# Altium schematic sheet myCar.SchDoc
size A2
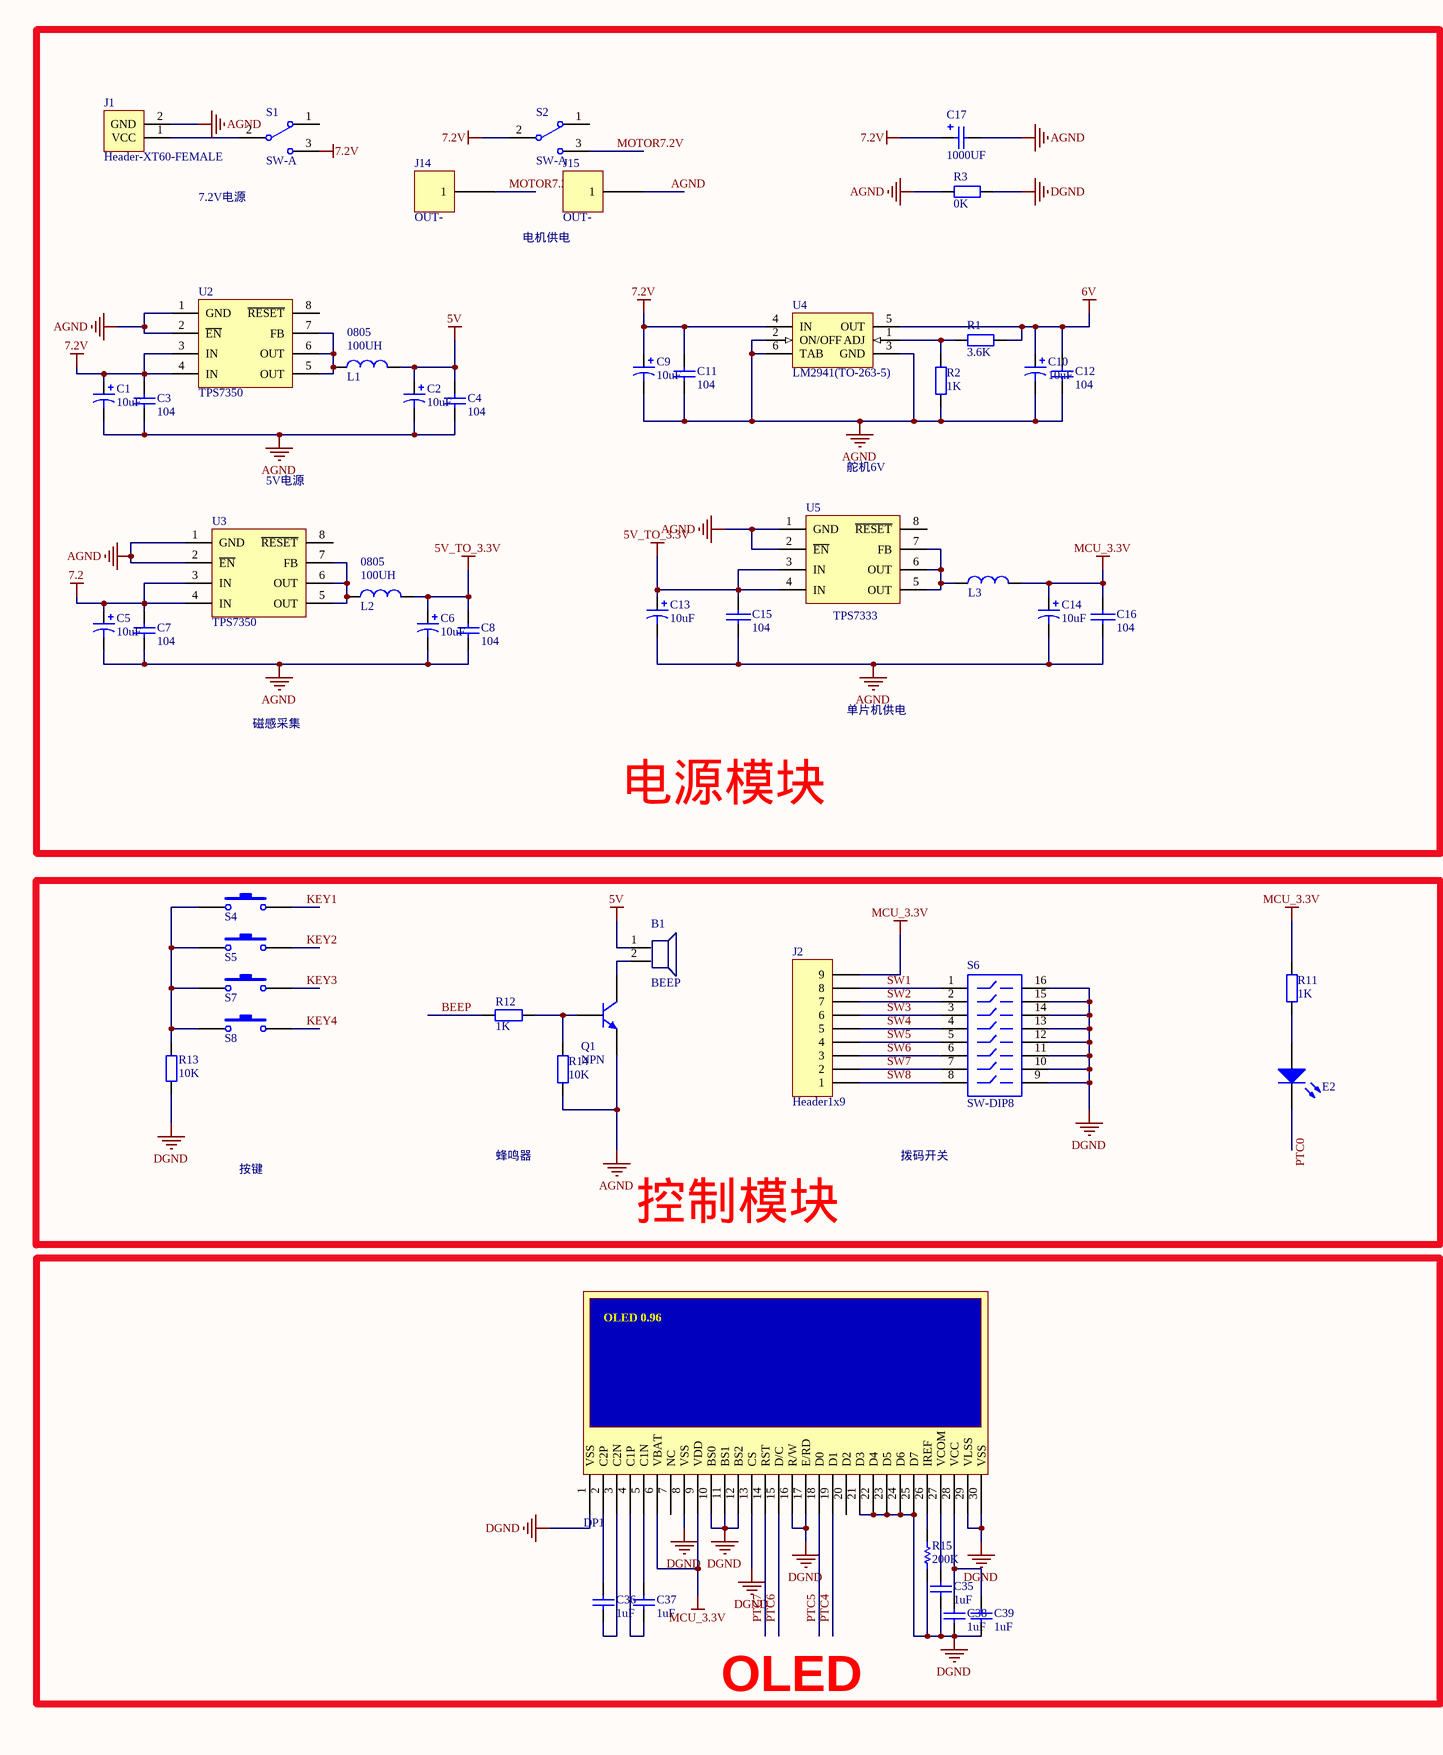
[diagram p0: myCar.SchDoc, left]
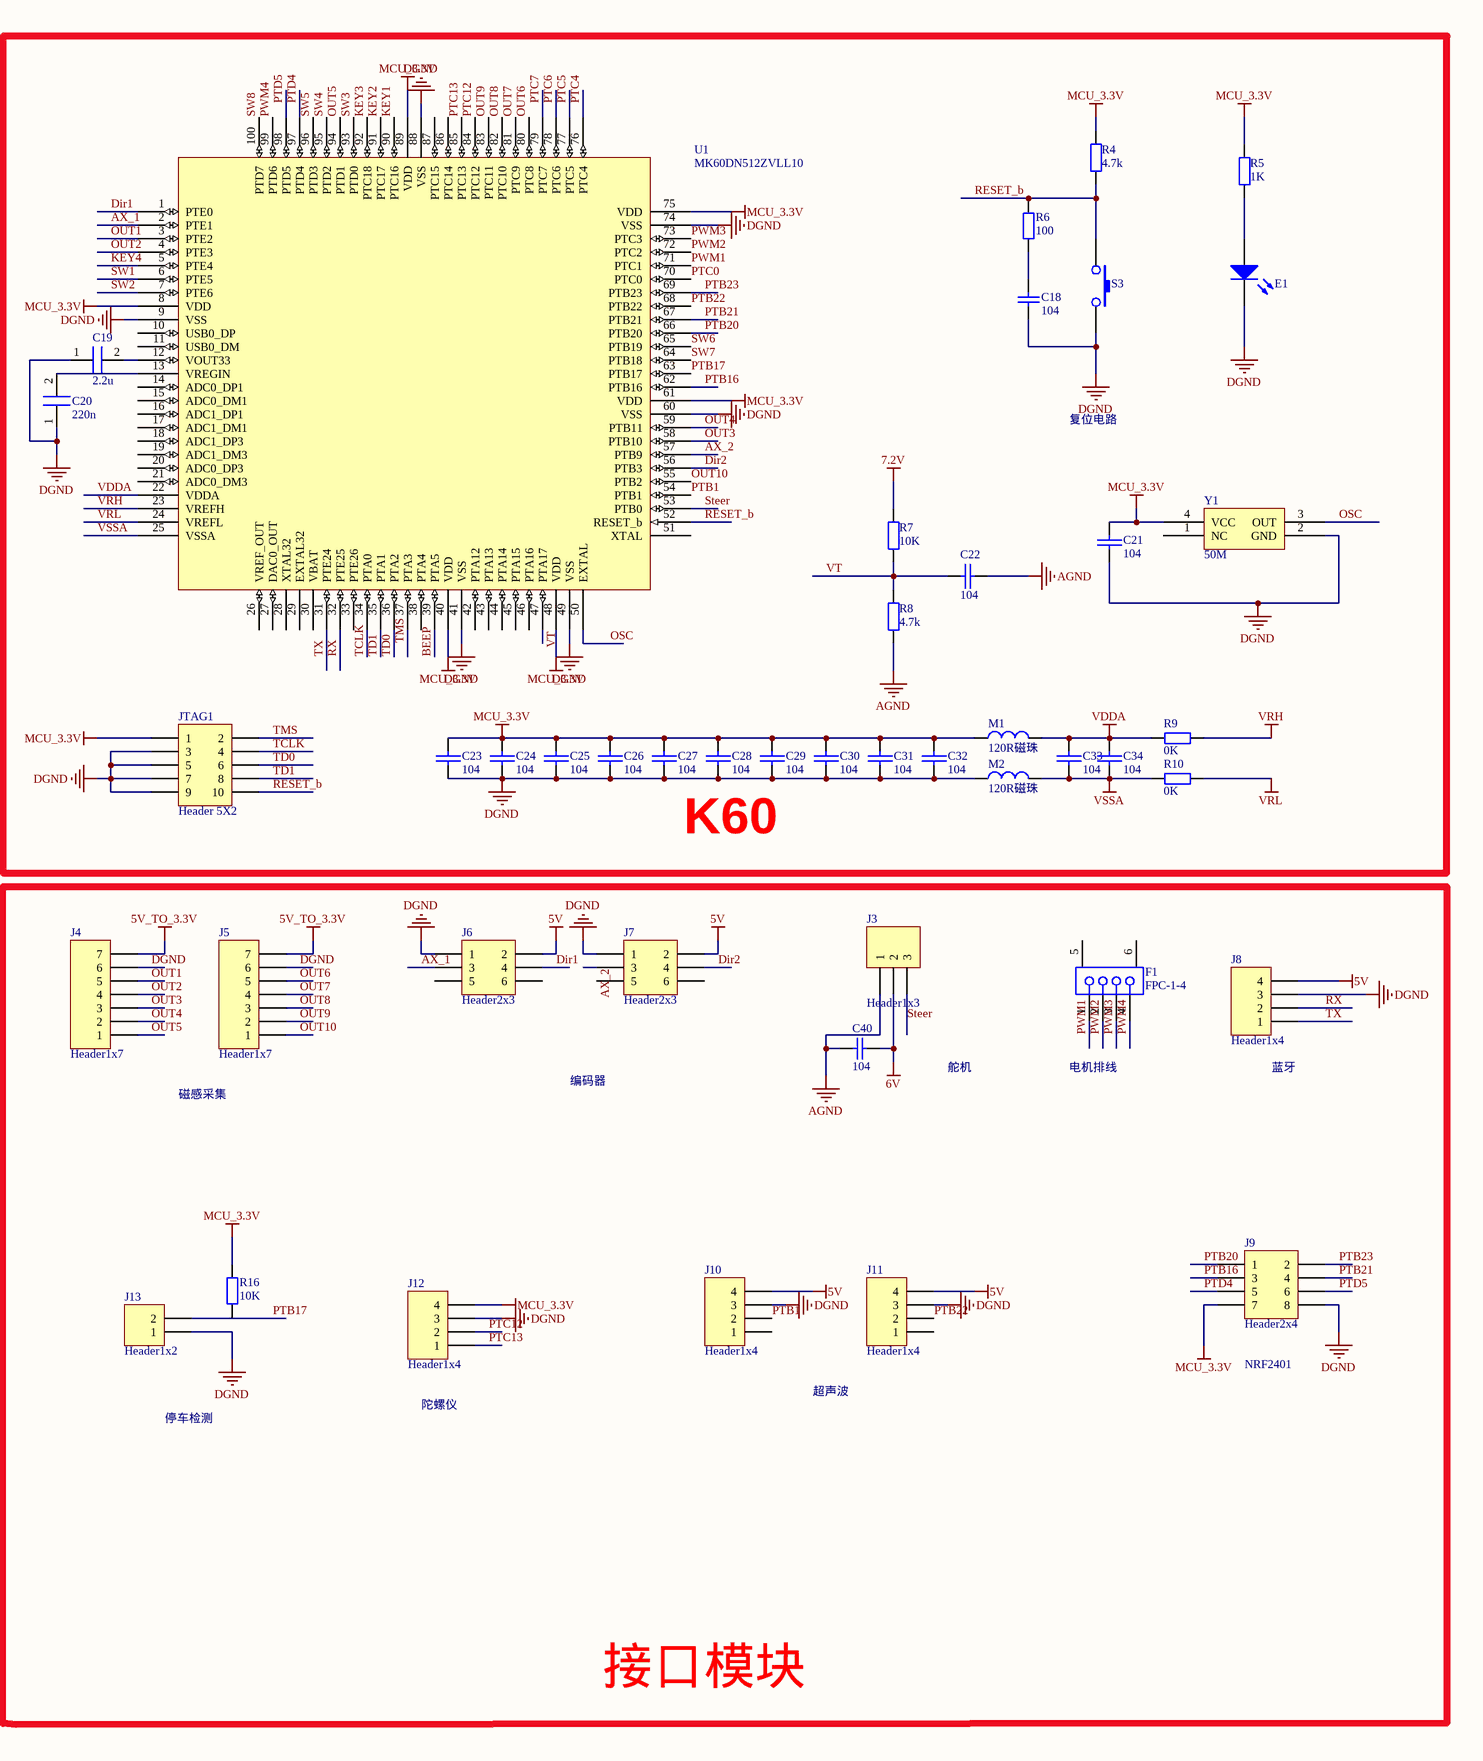
[diagram p1: myCar.SchDoc, right]

## Parts
B1  BEEP  [BEEP0905]
C1  value 10uF  [CAP_3216（1206）]  (hidden comment: 10uF/16V)
C2  value 10uF  [CAP_3216（1206）]  (hidden comment: 10uF/16V)
C3  104  [0603RC]
C4  104  [0603RC]
C5  value 10uF  [CAP_3216（1206）]  (hidden comment: 10uF/16V)
C6  value 10uF  [CAP_3216（1206）]  (hidden comment: 10uF/16V)
C7  104  [0603RC]
C8  104  [0603RC]
C9  value 10uF  [CAP_3216（1206）]  (hidden comment: 10uF/16V)
C10  value 10uF  [CAP_3216（1206）]  (hidden comment: 10uF/16V)
C11  104  [0603RC]
C12  104  [0603RC]
C13  value 10uF  [CAP_3216（1206）]  (hidden comment: 10uF/16V)
C14  value 10uF  [CAP_3216（1206）]  (hidden comment: 10uF/16V)
C15  104  [0603RC]
C16  104  [0603RC]
C17  CAP-SMD-1000UF  [CAP-SMD-1000UF]  (value not drawn)
C18  104  [0603RC]
C19  C: 2.2u  [0603RC]  (hidden comment: C0603)
C20  C: 220n  [0603RC]  (hidden comment: C0603)
C21  104  [0603RC]
C22  104  [0603RC]
C23  104  [0603RC]
C24  104  [0603RC]
C25  104  [0603RC]
C26  104  [0603RC]
C27  104  [0603RC]
C28  104  [0603RC]
C29  104  [0603RC]
C30  104  [0603RC]
C31  104  [0603RC]
C32  104  [0603RC]
C33  104  [0603RC]
C34  104  [0603RC]
C35  value 1uF  [0603RC]  (hidden comment: Cap)
C36  value 1uF  [0603RC]  (hidden comment: Cap)
C37  value 1uF  [0603RC]  (hidden comment: Cap)
C38  value 1uF  [0603RC]  (hidden comment: Cap)
C39  value 1uF  [0603RC]  (hidden comment: Cap)
C40  104  [0603RC]
DP1  OLED  [OLED_0.96]  (value not drawn)
E1  LED0  [LED-0603]  (value not drawn)
E2  LED0  [LED-0603]  (value not drawn)
F1  FPC-1-4  [FPC-1-4]
J1  Header-XT60-FEMALE  [HEADER-XT60-FEMALE]
J2  Header1x9  [HEADER1X9]
J3  Header1x3  [HEADER1X3]
J4  Header1x7  [HEADER1X7]
J5  Header1x7  [HEADER1X7]
J6  Header2x3  [HEADER2X3]
J7  Header2x3  [HEADER2X3]
J8  Header1x4  [HEADER1X4]
J9  Header2x4  [HEADER2X4]
J10  Header1x4  [HEADER1X4]
J11  Header1x4  [HEADER1X4]
J12  Header1x4  [HEADER1X4]
J13  Header1x2  [HEADER1X2]
J14  OUT-  [HEADER1X1]
J15  OUT-  [HEADER1X1]
JTAG1  Header 5X2  [HEADER2X5]
L1  INTUCTOR  [L0805 - duplicate]  (value not drawn)
L2  INTUCTOR  [L0805 - duplicate]  (value not drawn)
L3  INTUCTOR  [L0805 - duplicate]  (value not drawn)
M1  120R磁珠  [bead0805]
M2  120R磁珠  [bead0805]
Q1  NPN  [SOT-23]
R1  RES  [0603RC]  (value not drawn)
R2  1K  [0603RC]
R3  RES  [0603RC]  (value not drawn)
R4  value 4.7k  [0603RC]  (hidden comment: 2K)
R5  1K  [0603RC]
R6  RES  [0603RC]  (value not drawn)
R7  10K  [0603RC]
R8  value 4.7k  [0603RC]  (hidden comment: 2K)
R9  RES  [0603RC]  (value not drawn)
R10  RES  [0603RC]  (value not drawn)
R11  1K  [0603RC]
R12  1K  [0603RC]
R13  RES  [0603RC]  (value not drawn)
R14  10K  [0603RC]
R15  value 200K  [0603RC]  (hidden comment: Res)
R16  RES  [0603RC]  (value not drawn)
S1  SW-A  [SW-B]
S2  SW-A  [SW-B]
S3  SW-PB  [SWITCH]  (value not drawn)
S4  SW-PB  [SWITCH]  (value not drawn)
S5  SW-PB  [SWITCH]  (value not drawn)
S6  SW-DIP8  [DIP-16]
S7  SW-PB  [SWITCH]  (value not drawn)
S8  SW-PB  [SWITCH]  (value not drawn)
U1  MK60DN512ZVLL10  [QFP100]
U2  TPS7350  [TPS7350(7333)]
U3  TPS7350  [TPS7350(7333)]
U4  LM2941(TO-263-5)  [TO-263-5]
U5  TPS7333  [TPS7350(7333)]
Y1  50M  [50M晶振(5032)]

## Blocks framed on the sheet
电源模块: C1-C17 J1 J14 J15 L1-L3 R1-R3 S1 S2 U2-U5
K60: C18-C34 E1 JTAG1 M1 M2 R4-R10 S3 U1 Y1
控制模块: B1 E2 J2 Q1 R11-R14 S4-S8
接口模块: C40 F1 J3-J13 R16
OLED: C35-C39 DP1 R15

## Nets
5V: B1.1(VCC) C2.1 C4.2 J6.2 J7.2 J8.4 J10.4 J11.4 L1.2
5V_TO_3.3V: C6.1 C8.1 C13.1 C15.1 J4.7 J5.7 L2.2 U5.3(IN) U5.4(IN)
6V: C10.1 C12.2 C40.2 J3.2 R1.2 U4.5(OUT)
7.2: C5.1 C7.2 U3.3(IN) U3.4(IN)
7.2V: C1.1 C3.2 C9.1 C11.2 C17.1 R7.2 S1.3 S2.2 U2.3(IN) U2.4(IN) U4.4(IN)
AGND: C1.2 C2.2 C3.1 C4.1 C5.2 C6.2 C7.1 C8.2 C9.2 C10.2 C11.1 C12.1 C13.2 C14.2 C15.2 C16.2 C17.2 C22.2 C40.1 J1.2(GND) J3.1 J15.1 Q1.2(E) R2.1 R3.1 R8.1 R14.1 U2.1(GND) U2.2(~{EN}) U3.1(GND) U3.2(~{EN}) U4.2(ON/OFF) U4.3(GND) U4.6(TAB) U5.1(GND) U5.2(~{EN})
DGND: C18.1 C19.1 C20.1 C21.2 C23.2 C24.2 C25.2 C26.2 C27.2 C28.2 C29.2 C30.2 C31.2 C32.2 C35.1 C38.2 C39.1 DP1.1(VSS) DP1.8(VSS) DP1.10(BS0) DP1.11(BS1) DP1.12(BS2) DP1.13(CS) DP1.16(R/W) DP1.17(E/RD) DP1.21(D3) DP1.22(D4) DP1.23(D5) DP1.24(D6) DP1.25(D7) DP1.29(VLSS) DP1.30(VSS) E1.2 J4.6 J5.6 J6.1 J7.1 J8.3 J9.8 J10.3 J11.3 J12.3 J13.1 JTAG1.3 JTAG1.5 JTAG1.7 JTAG1.9 M2.1 R3.2 R13.1 R15.1 S3.2 S6.9 S6.10 S6.11 S6.12 S6.13 S6.14 S6.15 S6.16 U1.9(VSS) U1.41(VSS) U1.49(VSS) U1.60(VSS) U1.74(VSS) U1.88(VSS) Y1.2(GND)
MCU_3.3V: C14.1 C16.1 C21.1 C23.1 C24.1 C25.1 C26.1 C27.1 C28.1 C29.1 C30.1 C31.1 C32.1 DP1.6(VBAT) DP1.9(VDD) J2.9 J9.7 J12.4 JTAG1.1 L3.2 M1.1 R4.2 R5.2 R11.2 R16.2 U1.8(VDD) U1.40(VDD) U1.48(VDD) U1.61(VDD) U1.75(VDD) U1.89(VDD) Y1.4(VCC)
VDDA: C33.1 C34.1 M1.2 R9.1 U1.22(VDDA)
VRH: R9.2 U1.23(VREFH)
VRL: R10.2 U1.24(VREFL)
VSSA: C33.2 C34.2 M2.2 R10.1 U1.25(VSSA)
AX_1: J6.3 U1.2(PTE1)
AX_2: J7.3 U1.57(PTB9)
BEEP: R12.1 U1.39(PTA5)
Dir1: J6.4 U1.1(PTE0)
Dir2: J7.4 U1.56(PTB3)
KEY1: S4.2 U1.90(PTC16)
KEY2: S5.2 U1.91(PTC17)
KEY3: S7.2 U1.92(PTC18)
KEY4: S8.2 U1.5(PTE4)
MOTOR7.2V: J14.1 S2.3
OSC: U1.50(EXTAL) Y1.3(OUT)
OUT1: J4.5 U1.3(PTE2)
OUT2: J4.4 U1.4(PTE3)
OUT3: J4.3 U1.58(PTB10)
OUT4: J4.2 U1.59(PTB11)
OUT5: J4.1 U1.94(PTD1)
OUT6: J5.5 U1.80(PTC8)
OUT7: J5.4 U1.81(PTC9)
OUT8: J5.3 U1.82(PTC10)
OUT9: J5.2 U1.83(PTC11)
OUT10: J5.1 U1.55(PTB2)
PTB1: J10.2 U1.54(PTB1)
PTB16: J9.3 U1.62(PTB16)
PTB17: J13.2 U1.63(PTB17)
PTB20: J9.1 U1.66(PTB20)
PTB21: J9.4 U1.67(PTB21)
PTB22: J11.2 U1.68(PTB22)
PTB23: J9.2 U1.69(PTB23)
PTC0: E2.2 U1.70(PTC0)
PTC4: DP1.19(D1) U1.76(PTC4)
PTC5: DP1.18(D0) U1.77(PTC5)
PTC6: DP1.15(D/C) U1.78(PTC6)
PTC7: DP1.14(RST) U1.79(PTC7)
PTC12: J12.2 U1.84(PTC12)
PTC13: J12.1 U1.85(PTC13)
PTD4: J9.5 U1.97(PTD4)
PTD5: J9.6 U1.98(PTD5)
PWM1: F1.1 U1.71(PTC1)
PWM2: F1.2 U1.72(PTC2)
PWM3: F1.3 U1.73(PTC3)
PWM4: F1.4 U1.99(PTD6)
RESET_b: JTAG1.10 R4.1 R6.2 S3.1 U1.52(RESET_b)
RX: J8.2 U1.32(PTE25)
Steer: J3.3 U1.53(PTB0)
SW1: J2.8 S6.1 U1.6(PTE5)
SW2: J2.7 S6.2 U1.7(PTE6)
SW3: J2.6 S6.3 U1.93(PTD0)
SW4: J2.5 S6.4 U1.95(PTD2)
SW5: J2.4 S6.5 U1.96(PTD3)
SW6: J2.3 S6.6 U1.65(PTB19)
SW7: J2.2 S6.7 U1.64(PTB18)
SW8: J2.1 S6.8 U1.100(PTD7)
TCLK: JTAG1.4 U1.34(PTA0)
TD0: JTAG1.6 U1.36(PTA2)
TD1: JTAG1.8 U1.35(PTA1)
TMS: JTAG1.2 U1.37(PTA3)
TX: J8.1 U1.31(PTE24)
VT: C22.1 R7.1 R8.2 U1.47(PTA17)
NetB1_2: B1.2(GND) Q1.3(C)
NetC18_2: C18.2 R6.1
NetC19_2: C19.2 U1.12(VOUT33)
NetC20_2: C20.2 U1.13(VREGIN)
NetC35_2: C35.2 DP1.27(VCOM)
NetC36_1: C36.1 DP1.3(C2N)
NetC36_2: C36.2 DP1.2(C2P)
NetC37_1: C37.1 DP1.4(C1P)
NetC37_2: C37.2 DP1.5(C1N)
NetC38_1: C38.1 C39.2 DP1.28(VCC)
NetDP1_26: DP1.26(IREF) R15.2
NetE1_1: E1.1 R5.1
NetE2_1: E2.1 R11.1
NetJ1_1: J1.1(VCC) S1.2
NetL1_1: L1.1 U2.5(OUT) U2.6(OUT) U2.7(FB)
NetL2_1: L2.1 U3.5(OUT) U3.6(OUT) U3.7(FB)
NetL3_1: L3.1 U5.5(OUT) U5.6(OUT) U5.7(FB)
NetQ1_1: Q1.1(B) R12.2 R14.2
NetR1_1: R1.1 R2.2 U4.1(ADJ)
NetR13_2: R13.2 S4.1 S5.1 S7.1 S8.1

Not connected (* = marked no-connect by the designer): DP1 7(NC) 20(D2); F1 5(MH1) 6(MH2); J6 5 6; J7 5 6; J10 1; J11 1; R16 1; S1 1; S2 1; U1 10(USB0_DP) 11(USB0_DM) 14(ADC0_DP1) 15(ADC0_DM1) 16(ADC1_DP1) 17(ADC1_DM1) 18(ADC1_DP3) 19(ADC1_DM3) 20(ADC0_DP3) 21(ADC0_DM3) 26(VREF_OUT) 27(DAC0_OUT) 28(XTAL32) 29(EXTAL32) 30(VBAT) 33(PTE26) 38(PTA4) 42(PTA12) 43(PTA13) 44(PTA14) 45(PTA15) 46(PTA16) 51(XTAL) 86(PTC14) 87(PTC15); U2 8(~{RESET}); U3 8(~{RESET}); U5 8(~{RESET}); Y1 1(NC)

## Notes on the sheet
- 7.2V电源
- 电机供电
- (near L1) 100UH
- (near L1) 0805
- 复位电路
- 5V电源
- 舵机6V
- (near L2) 0805
- (near L2) 100UH
- 磁感采集
- 单片机供电
- 编码器
- 舵机
- 电机排线
- (near J8) 蓝牙
- 按键
- 蜂鸣器
- 拨码开关
- NRF2401
- 停车检测
- 陀螺仪
- 超声波
- (in symbol CAP-SMD-1000UF) 1000UF
- (in symbol OLED-0.96) OLED 0.96
- (in symbol RES) 3.6K; 0K; 100; 10K

## Library data of the parts
B1 = BEEP0905
C1 C2 C5 C6 C9 C10 C13 C14 = Cap Pol1: Polarized Capacitor (Radial); Published: 8-Jun-2000; LatestRevisionDate: 17-Jul-2002; LatestRevisionNote: Re-released for DXP Platform.; PackageReference: RB7.6-15; Publisher: Altium Limited; PackageDescription: Polarized Capacitor (Radial); 2 Leads
C3 C4 C7 C8 C11 C12 C18 C40 = Cap: Capacitor; Published: 8-Jun-2000; LatestRevisionDate: 17-Jul-2002; LatestRevisionNote: Re-released for DXP Platform.; PackageReference: RAD-0.3; Publisher: Altium Limited; PackageDescription: Radial Cap, Thru-Hole; 2 Leads; 0.3 in Pin Spacing; Value: 104
C15 C16 C21-C34 = CAP_1: Capacitor
C35-C39 = Cap_2: Capacitor; Published: 8-Jun-2000; LatestRevisionDate: 17-Jul-2002; LatestRevisionNote: Re-released for DXP Platform.; PackageReference: RAD-0.3; Publisher: Altium Limited
DP1 = OLED-0.96
E1 E2 = LED0: Typical INFRARED GaAs LED; Published: 8-Jun-2000; LatestRevisionDate: 08-Jul-2005; LatestRevisionNote: Mech Layer 1 removed.; PackageReference: LED-0; Publisher: Altium Limited
J1 = Header-XT60-FEMALE: 航模接头
J14 J15 = Header1x1
JTAG1 = Header 5X2: Header, 5-Pin, Dual row; LatestRevisionDate: 17-Jul-2002; LatestRevisionNote: Re-released for DXP Platform.; Publisher: Altium Limited
M1 M2 = 磁珠
Q1 = NPN(SOT-23): NPN Bipolar Transistor; Published: 8-Jun-2000; LatestRevisionDate: 17-Jul-2002; LatestRevisionNote: Re-released for DXP Platform.; PackageReference: TO-226; Publisher: Altium Limited; Code_JEDEC: TO-226-AA
R2 R5 R11 R12 = Res2: Resistor; Published: 8-Jun-2000; LatestRevisionDate: 17-Jul-2002; LatestRevisionNote: Re-released for DXP Platform.; PackageReference: AXIAL-0.4; Publisher: Altium Limited; Value: 1K
R4 R8 = Res2_2: Resistor; Published: 8-Jun-2000; LatestRevisionDate: 17-Jul-2002; LatestRevisionNote: Re-released for DXP Platform.; PackageReference: AXIAL-0.4; Publisher: Altium Limited; PackageDescription: Axial Device, Thru-Hole; 2 Leads; 0.4 in Pin Spacing
R7 R14 = Res2_1: Resistor; Published: 8-Jun-2000; LatestRevisionDate: 17-Jul-2002; LatestRevisionNote: Re-released for DXP Platform.; PackageReference: AXIAL-0.4; Publisher: Altium Limited; PackageDescription: Axial Device, Thru-Hole; 2 Leads; 0.4 in Pin Spacing; Value: 10K
R15 = Res_1: 贴片电阻; Published: 8-Jun-2000; LatestRevisionDate: 17-Jul-2002; LatestRevisionNote: Re-released for DXP Platform.; PackageReference: AXIAL-0.3; Publisher: Altium Limited
S3 = SW-PB_SMT
S4 S5 S7 S8 = SW-PB: Switch; Published: 24-Mar-1999; LatestRevisionDate: 17-Jul-2002; LatestRevisionNote: Re-released for DXP Platform.; PackageReference: SPST-2; Publisher: Altium Limited; PackageDescription: Switch; 2 Leads
U5 = TPS7350
Y1 = XTAL_S: Frequent: 50M